# EAGLE design R2P_PS_module (EAGLE 6.4)
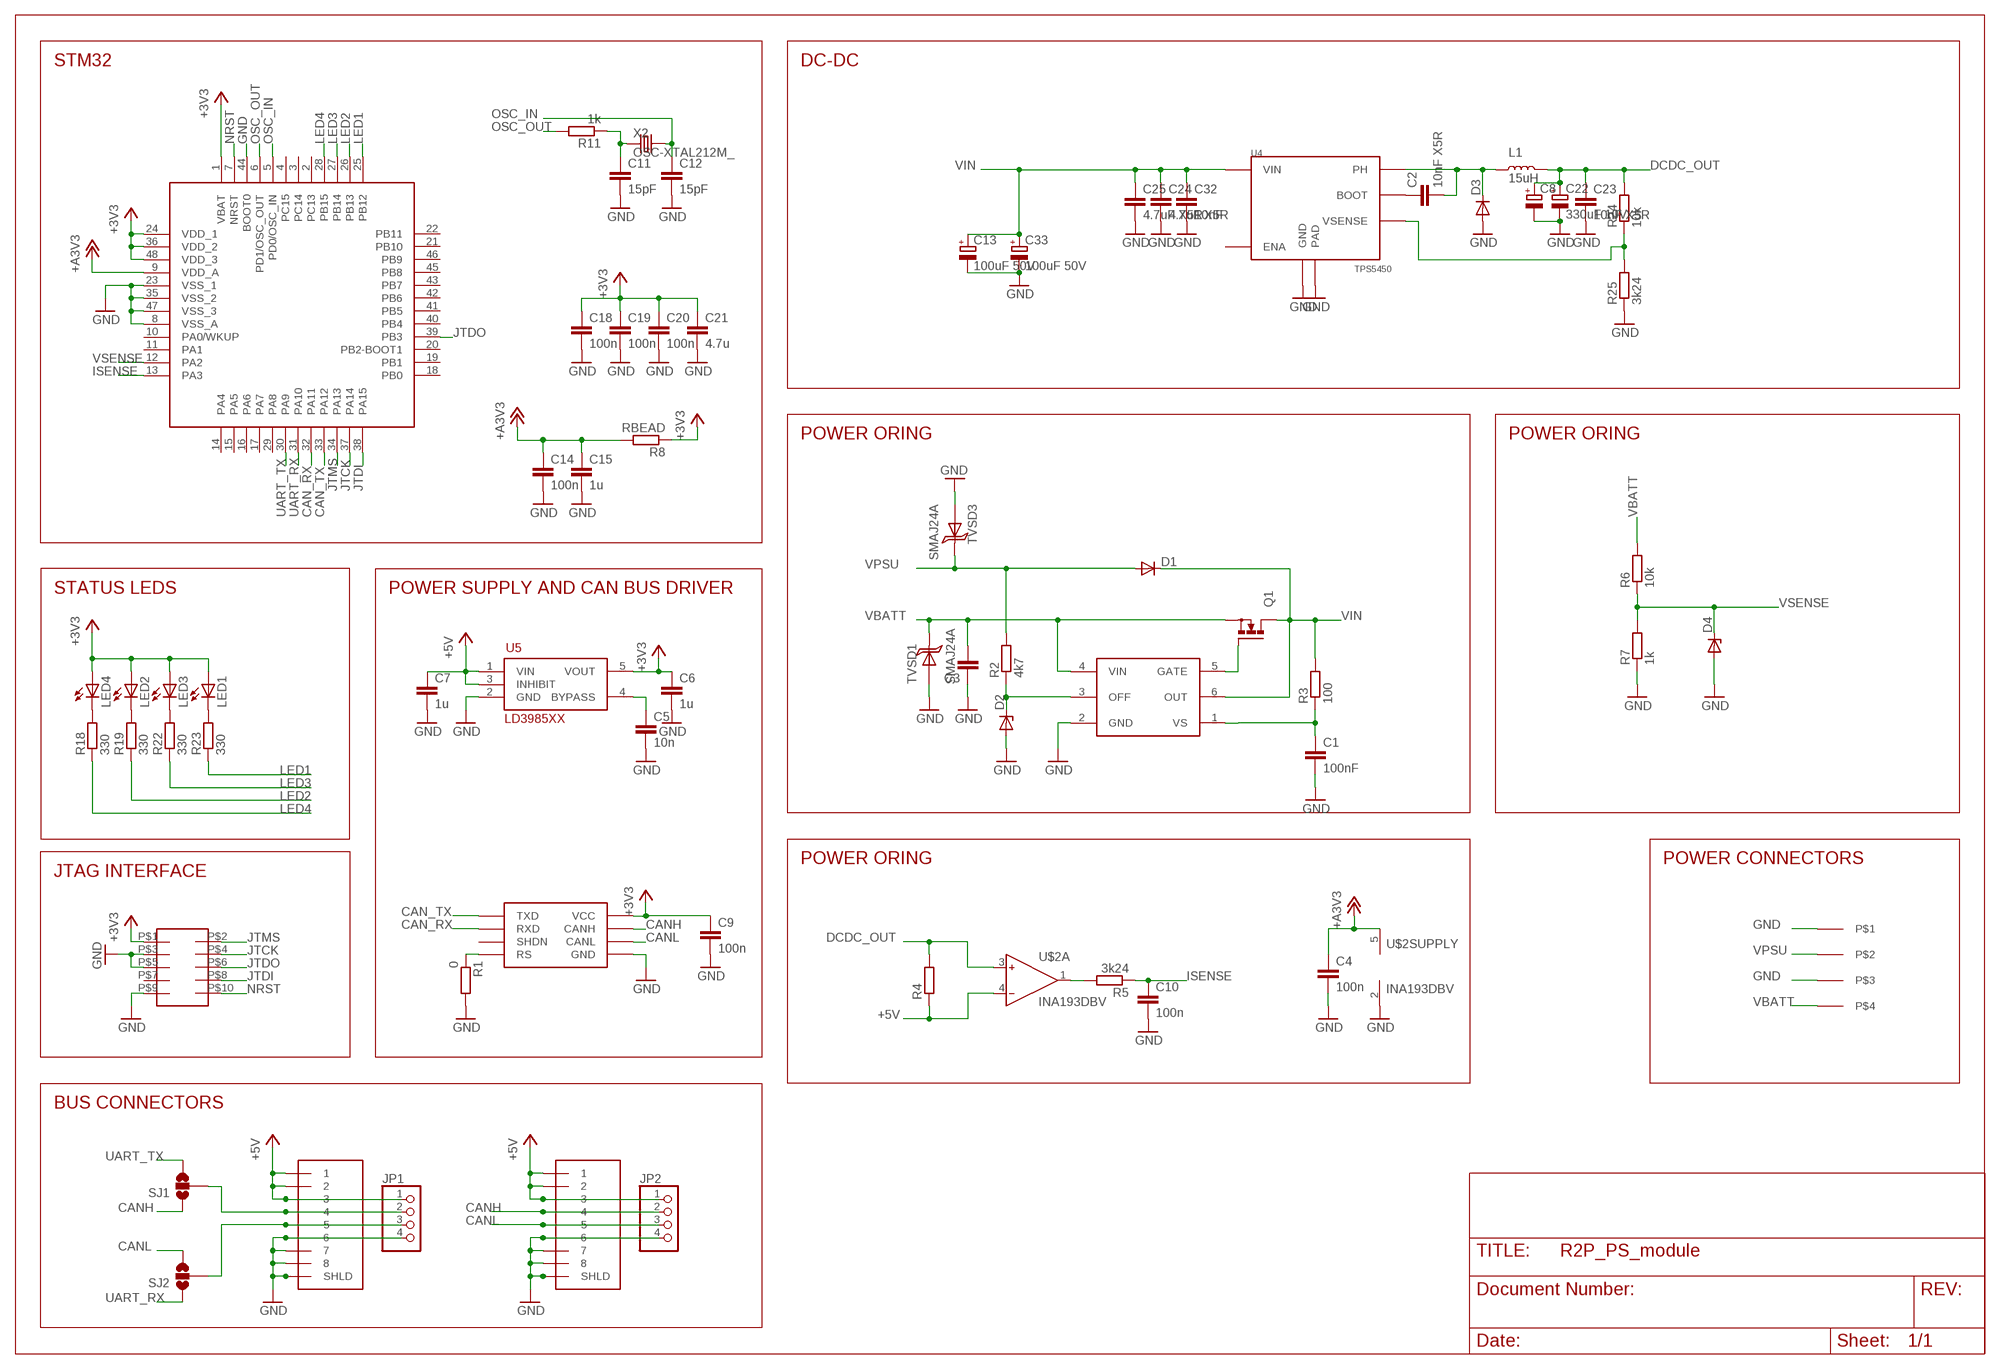
[diagram p0: schematic, sheet 1]

## Parts
1  RJ45-43860  [0438600010]
2  RJ45-43860  [0438600010]
C1  100nF  C-EUC0603  [C0603]
C2  10nF X5R  C-EUC0603  [C0603]
C3  C-EUC0805  [C0805]
C4  100n  C-EUC0603  [C0603]
C5  10n  C-EUC0603  [C0603]
C6  1u  C-EUC0603  [C0603]
C7  1u  C-EUC0603  [C0603]
C8  CPOL-EUE5-10.5  [E5-10,5]
C9  100n  C-EUC0603  [C0603]
C10  100n  C-EUC0603  [C0603]
C11  15pF  C-EUC0603  [C0603]
C12  15pF  C-EUC0603  [C0603]
C13  100uF 50V  CPOL-EUE5-10.5  [E5-10,5]
C14  100n  C-EUC0603  [C0603]
C15  1u  C-EUC0603  [C0603]
C18  100n  C-EUC0603  [C0603]
C19  100n  C-EUC0603  [C0603]
C20  100n  C-EUC0603  [C0603]
C21  4.7u  C-EUC0805  [C0805]
C22  330uF 10V  CPOL-EUE2.5-7  [E2,5-7]
C23  10nF X5R  C-EUC0603  [C0603]
C24  4.7uF X5R  C-EUC1210  [C1210]
C25  4.7uF X5R  C-EUC1210  [C1210]
C32  10nF  C-EUC0603  [C0603]
C33  100uF 50V  CPOL-EUE2.5-7  [E2,5-7]
D1  DIODE-DO-214AC  [DO-214AC]
D2  ZENERSOD-323F  [SOD-323F]
D3  DIODE-DO-214AC  [DO-214AC]
D4  ZENERSOD-323F  [SOD-323F]
JP1  PINHD-1X4/90  [1X04/90]
JP2  PINHD-1X4/90  [1X04/90]
L1  15uH  CDRH127  [CDRH127]
LED1  LEDCHIPLED_0805  [CHIPLED_0805]
LED2  LEDCHIPLED_0805  [CHIPLED_0805]
LED3  LEDCHIPLED_0805  [CHIPLED_0805]
LED4  LEDCHIPLED_0805  [CHIPLED_0805]
Q1  N-MOSFET-SO8S  [SO-08]
R1  0  R-EU_R0603  [R0603]
R2  4k7  R-EU_R0603  [R0603]
R3  100  R-EU_R0603  [R0603]
R4  R-EU_R2512  [R2512]
R5  3k24  R-EU_R0603  [R0603]
R6  10k  R-EU_R0603  [R0603]
R7  1k  R-EU_R0603  [R0603]
R8  RBEAD  R-EU_R0603  [R0603]
R11  1k  R-EU_R0603  [R0603]
R18  330  R-EU_R0603  [R0603]
R19  330  R-EU_R0603  [R0603]
R22  330  R-EU_R0603  [R0603]
R23  330  R-EU_R0603  [R0603]
R24  10k  R-EU_R0603  [R0603]
R25  3k24  R-EU_R0603  [R0603]
SJ1  SOLDERJUMPER_2WAYPASTE1&2  [SJ_3_PASTE1&2]
SJ2  SOLDERJUMPER_2WAYPASTE1&2  [SJ_3_PASTE1&2]
SOT1  MAX3051  [SOT23-8L]
TVSD1  SMAJ24A  TVSDSMA  [SMA]
TVSD3  SMAJ24A  TVSDSMA  [SMA]
U1  STM32F103CX  [LQFP48]
U4  TPS5450  [POWERPAD-SO8]
U5  LD3985XX  [SOT23-5L]
U$1  LM5050-1  [SOT23-6L]
U$2  INA193DBV  [SOT23-5L]
U$3  POWERCONN-4  [POWERCONN-4]
U$4  FTSH-105  [FTSH-105]
X2  OSC-XTAL212M_  [4X6]

## Nets
+3V3: C6.1 C9.1 C18.1 C19.1 C20.1 C21.1 LED1.A LED2.A LED3.A LED4.A R8.1 SOT1.P$3(VCC) U1.1(VBAT) U1.24(VDD_1) U1.36(VDD_2) U1.48(VDD_3) U5.5(VOUT) U$4.P$1
+5V: 1.P$1 1.P$2 1.P$3 2.P$1 2.P$2 2.P$3 C7.1 JP1.1 JP2.1 R4.1 U5.1(VIN) U5.3(INHIBIT) U$2.4(A:IN-)
+A3V3: C4.1 C14.1 C15.1 R8.2 U1.9(VDD_A) U$2.5(SUPPLY:V+)
CAN_RX: SOT1.P$4(RXD) U1.32(PA11)
CAN_TX: SOT1.P$1(TXD) U1.33(PA12)
CANH: 2.P$4 JP2.2 SJ1.1 SOT1.P$7(CANH)
CANL: 2.P$5 JP2.3 SJ2.3 SOT1.P$6(CANL)
DCDC_OUT: C8.+ C22.+ C23.1 L1.P$2 R4.2 R24.2 U$2.3(A:IN+)
GND: 1.P$6 1.P$7 1.P$8 1.P$9(SHLD) 1.P$10 2.P$6 2.P$7 2.P$8 2.P$9(SHLD) 2.P$10 C1.2 C3.1 C4.2 C5.2 C6.2 C7.2 C8.- C9.2 C10.2 C11.2 C12.2 C13.- C14.2 C15.2 C18.2 C19.2 C20.2 C21.2 C22.- C23.2 C24.2 C25.2 C32.2 C33.- D2.A D3.A D4.A JP1.4 JP2.4 R1.2 R7.1 R25.1 SOT1.P$2(GND) TVSD1.A TVSD3.A U1.8(VSS_A) U1.23(VSS_1) U1.35(VSS_2) U1.44(BOOT0) U1.47(VSS_3) U4.P6(GND) U4.PAD U5.2(GND) U$1.2(GND) U$2.2(SUPPLY:V-) U$3.P$1 U$3.P$3 U$4.P$3 U$4.P$5 U$4.P$9
ISENSE: C10.1 R5.1 U1.13(PA3)
JTCK: U1.37(PA14) U$4.P$4
JTDI: U1.38(PA15) U$4.P$8
JTDO: U1.39(PB3) U$4.P$6
JTMS: U1.34(PA13) U$4.P$2
LED1: R23.1 U1.25(PB12)
LED2: R19.1 U1.26(PB13)
LED3: R22.1 U1.27(PB14)
LED4: R18.1 U1.28(PB15)
N$2: R1.1 SOT1.P$8(RS)
N$3: 1.P$4 JP1.2 SJ1.2
N$4: C5.1 U5.4(BYPASS)
N$6: D2.C R2.1 U$1.3(OFF)
N$7: Q1.4(G) U$1.5(GATE)
N$8: 1.P$5 JP1.3 SJ2.2
N$9: C1.1 R3.1 U$1.1(VS)
N$12: C11.1 R11.1 X2.1(X1)
N$14: R5.2 U$2.1(A:OUT)
N$15: LED4.C R18.2
N$18: LED2.C R19.2
N$20: LED3.C R22.2
N$22: LED1.C R23.2
N$38: C2.1 U4.P1(BOOT)
N$48: R24.1 R25.2 U4.P4(VSENSE)
NRST: U1.7(NRST) U$4.P$10
OSC_IN: C12.1 U1.5(PD0/OSC_IN) X2.2(X2)
OSC_OUT: R11.2 U1.6(PD1/OSC_OUT)
PH: C2.2 D3.C L1.P$1 U4.P8(PH)
UART_RX: SJ2.1 U1.31(PA10)
UART_TX: SJ1.3 U1.30(PA9)
VBATT: C3.2 Q1.1(S) Q1.2(S) Q1.3(S) R6.2 TVSD1.C(K) U$1.4(VIN) U$3.P$4
VIN: C13.+ C24.1 C25.1 C32.1 C33.+ D1.C Q1.5(D) Q1.6(D) Q1.7(D) Q1.8(D) R3.2 U4.P7(VIN) U$1.6(OUT)
VPSU: D1.A R2.2 TVSD3.C(K) U$3.P$2
VSENSE: D4.C R6.1 R7.2 U1.12(PA2)
Unconnected: SOT1.P$5(SHDN) U1.2(PC13) U1.3(PC14) U1.4(PC15) U1.10(PA0/WKUP) U1.11(PA1) U1.14(PA4) U1.15(PA5) U1.16(PA6) U1.17(PA7) U1.18(PB0) U1.19(PB1) U1.20(PB2-BOOT1) U1.21(PB10) U1.22(PB11) U1.29(PA8) U1.40(PB4) U1.41(PB5) U1.42(PB6) U1.43(PB7) U1.45(PB8) U1.46(PB9) U4.P5(ENA) U$4.P$7

## Notes on the sheet
- STM32 | DC-DC
- POWER ORING | POWER ORING
- STATUS LEDS | POWER SUPPLY AND CAN BUS DRIVER
- POWER ORING | POWER CONNECTORS
- JTAG INTERFACE
- BUS CONNECTORS

## Library data of the parts
1 2 = molex:RJ45-43860
C1-C7 C9-C12 C14 C15 C18-C21 C23-C25 C32 = rcl:C-EU: CAPACITOR, European symbol
C8 C13 C22 C33 = rcl:CPOL-EU: POLARIZED CAPACITOR, European symbol
D1 D3 = diode:DIODE-: DIODE
D2 D4 = dp_devices:ZENER: Zener Diode SOD-323
JP1 JP2 = pinhead:PINHD-1X4: PIN HEADER
L1 = DCDC:CDRH127
LED1-LED4 = led:LED: LED OSRAM: - CHIPLED LG R971, LG N971, LY N971, LG Q971, LY Q971, LO R971, LY R971 LH N974, LH R974 LS Q976, LO Q976, LY Q976 LO Q996 - Hyper CHIPLED LW Q18S LB Q993, LB Q99A, LB R99A - SideLED LS A670, LO A670, LY A670, LG A670, LP A670 LB A673, LV A673, LT A673, LW A673 LH A674 LY A675 LS A676, LA A676, LO A676, LY A676, LW A676 LS A679, LY A679, LG A679 - Hyper Micro SIDELED® LS Y876, LA Y876, LO Y876, LY Y876 LT Y87S - SmartLED LW L88C, LW L88S LB L89C, LB L89S, LG L890 LS L89K, LO L89K, LY L89K LS L896, LA L896, LO L896, LY L896 - TOPLED LS T670, LO T670, LY T670, LG T670, LP T670 LSG T670, LSP T670, LSY T670, LOP T670, LYG T670 LG T671, LOG T671, LSG T671 LB T673, LV T673, LT T673, LW T673 LH T674 LS T676, LA T676, LO T676, LY T676, LB T676, LH T676, LSB T676, LW T676 LB T67C, LV T67C, LT T67C, LS T67K, LO T67K, LY T67K, LW E67C LS E67B, LA E67B, LO E67B, LY E67B, LB E67C, LV E67C, LT E67C LW T67C LS T679, LY T679, LG T679 LS T770, LO T770, LY T770, LG T770, LP T770 LB T773, LV T773, LT T773, LW T773 LH T774 LS E675, LA E675, LY E675, LS T675 LS T776, LA T776, LO T776, LY T776, LB T776 LHGB T686 LT T68C, LB T68C - Hyper Mini TOPLED® LB M676 - Mini TOPLED Santana® LG M470 LS M47K, LO M47K, LY M47K Source: http://www.osram.convergy.de LUXEON: - LUMILED® LXK2-PW12-R00, LXK2-PW12-S00, LXK2-PW14-U00, LXK2-PW14-V00 LXK2-PM12-R00, LXK2-PM12-S00, LXK2-PM14-U00 LXK2-PE12-Q00, LXK2-PE12-R00, LXK2-PE12-S00, LXK2-PE14-T00, LXK2-PE14-U00 LXK2-PB12-K00, LXK2-PB12-L00, LXK2-PB12-M00, LXK2-PB14-N00, LXK2-PB14-P00, LXK2-PB14-Q00 LXK2-PR12-L00, LXK2-PR12-M00, LXK2-PR14-Q00, LXK2-PR14-R00 LXK2-PD12-Q00, LXK2-PD12-R00, LXK2-PD12-S00 LXK2-PH12-R00, LXK2-PH12-S00 LXK2-PL12-P00, LXK2-PL12-Q00, LXK2-PL12-R00 Source: www.luxeon.com KINGBRIGHT: KA-3528ASYC Source: www.kingbright.com
Q1 = transistor-power:N-MOSFET-SO8: N-Channel MOSFET Example: FDS7760A; N-Channel Logic Level PowerTrench® MOSFET FDS2572; N-Channel UltraFET® Trench MOSFET Source: www.fairchildsemi.com
R1-R8 R11 R18 R19 R22-R25 = rcl:R-EU_: RESISTOR, European symbol
SJ1 SJ2 = SparkFun:SOLDERJUMPER_2WAY: Solder Jumper 2 way solder jumper
SOT1 = maxim:MAX3051
TVSD1 TVSD3 = TVSD:TVSD
U1 = st:STM32F103CX
U4 = DCDC:TPS5450
U5 = st:LD3985XX
U$1 = texas-instruments:LM5050-1
U$2 = texas-instruments:INA193: Current Shunt Monitor -16V to +80V Common-Mode Range
U$3 = misc:POWERCONN-4
U$4 = samtec:FTSH-105
X2 = dp_devices:OSC-XTAL2

## Board
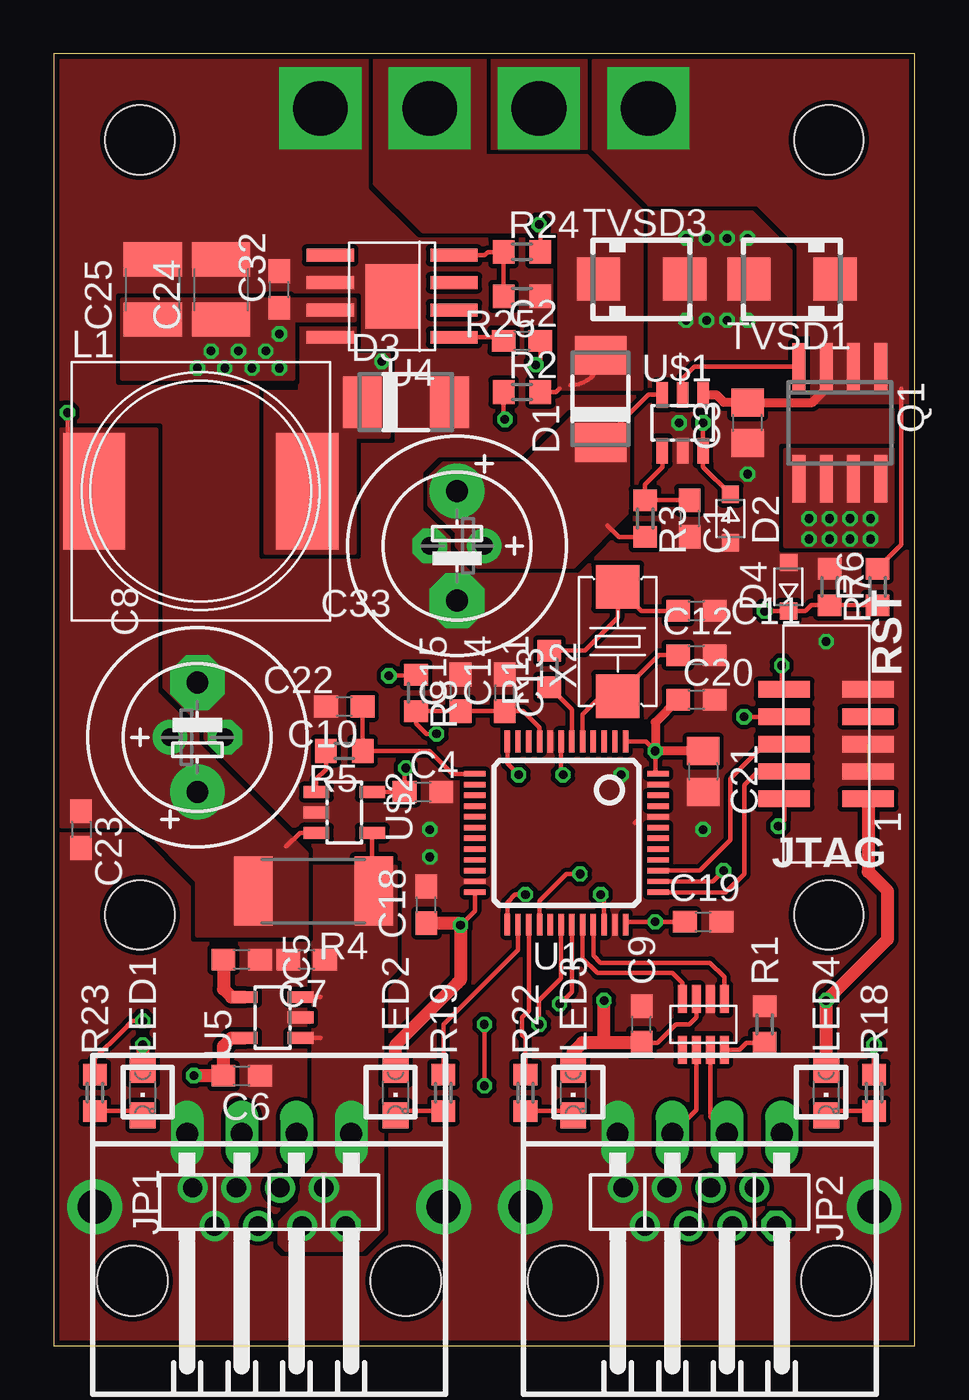
[diagram p1: board, top side]
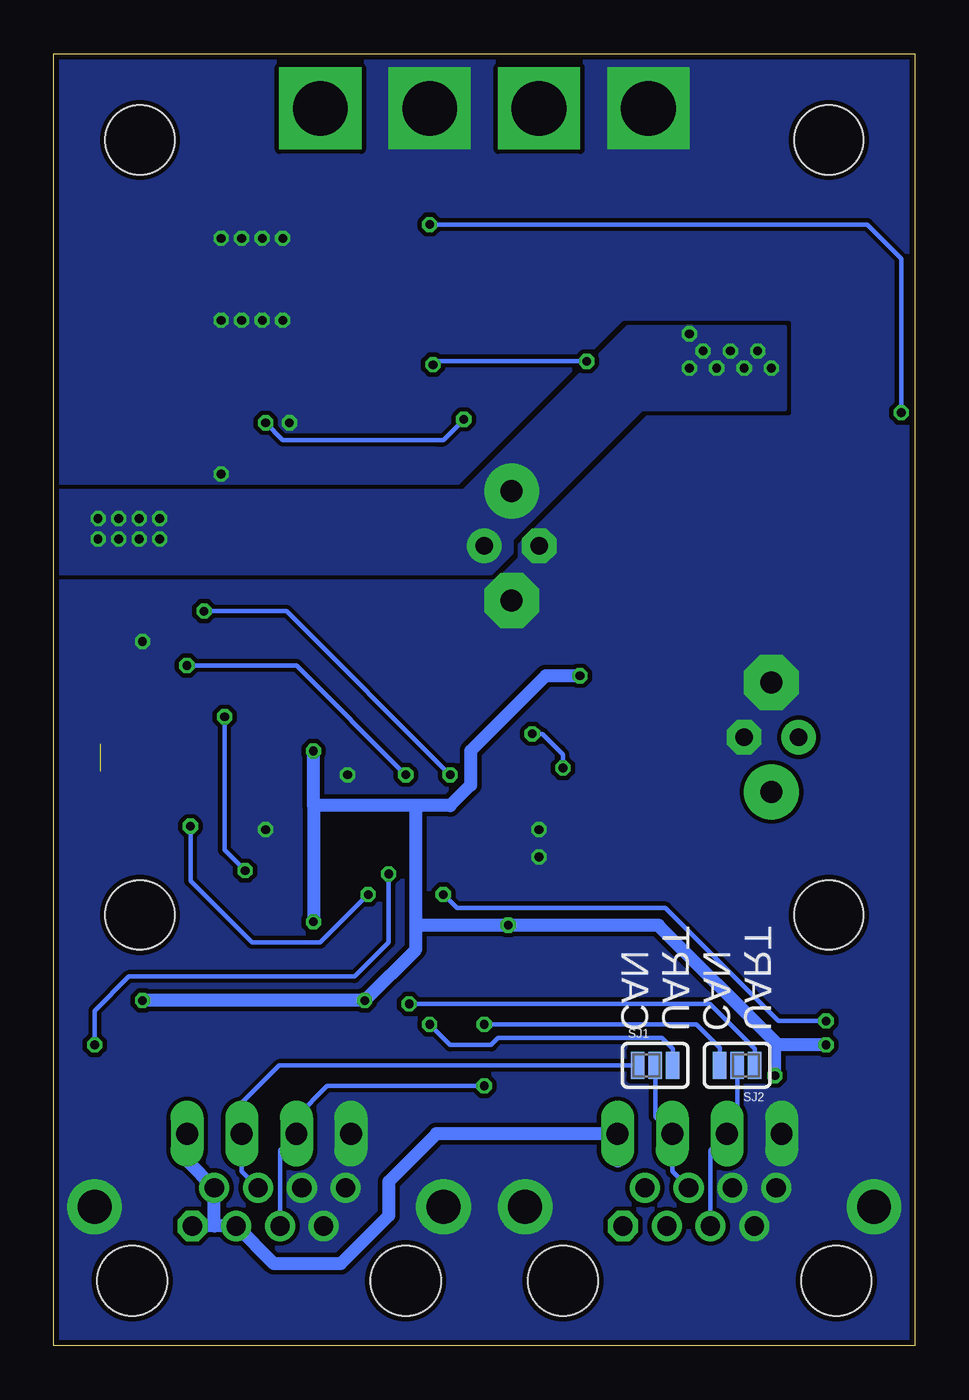
[diagram p2: board, bottom side, seen from below]

Size 40 x 60 mm. Coordinates in mm from the lower left corner, seen from the top.
Outline: 0,0 40,0 40,60 0,60 0,0
Copper layers (1*16): Top 0.035mm / dielectric 1.5mm / Bottom 0.035mm
Design rules "default": minimum track width 8mil, minimum drill 0.3mm, track to track 8mil, track to pad 8mil, pad to pad 8mil, via to via 8mil, smd to smd 0mil, copper to edge 10mil, drill to drill 10mil, minimum pad ring 10mil, minimum via ring 6mil, stop-mask expansion 2mil, vias tented up to drill 100mil, thermal gap 10mil
Holes 3.2 mm at 4,20 36,20 4,56 36,56

### Footprints (pad centres in the part's own frame; a part is rotated, then mirrored left to right if it is on the bottom)
0438600010 = drill 0.889 octagon: P$1 3.556,2.54 | drill 0.889: P$2 2.54,4.318; P$3 1.524,2.54; P$4 0.508,4.318; P$5 -0.508,2.54; P$6 -1.524,4.318; P$7 -2.54,2.54; P$8 -3.556,4.318 | drill 1.575 pad 2.54: P$9 8.103,3.429; P$10 -8.103,3.429 | hole 3.251: -6.35,0; 6.35,0
C0603 = smd 1.1 x 1: 1 -0.85,0; 2 0.85,0
C0805 = smd 1.3 x 1.5: 1 -0.95,0; 2 0.95,0
E5-10,5 = drill 1.016 pad 2.54: + -2.54,0 | drill 1.016 pad 2.54 octagon: - 2.54,0
E2,5-7 = drill 0.813 pad 1.6: + -1.27,0 | drill 0.813 pad 1.6 octagon: - 1.27,0
C1210 = smd 1.6 x 2.7: 1 -1.4,0; 2 1.4,0
DO-214AC = smd 1.8 x 2.4: A 2.025,0; C -2.025,0
SOD-323F = smd 0.8 x 0.8: A 1.125,0; C -1.125,0
1X04/90 = drill 1.016 long: 1 -3.81,-3.81; 2 -1.27,-3.81; 3 1.27,-3.81; 4 3.81,-3.81
CDRH127 = smd 5.4 x 2.9: P$1 0,4.95; P$2 0,-4.95
CHIPLED_0805 = smd 1.2 x 1.2: A 0,-1.05; C 0,1.05
SO-08 = smd 0.6 x 2.2: 1 -1.905,-2.6; 2 -0.635,-2.6; 3 0.635,-2.6; 4 1.905,-2.6; 5 1.905,2.6; 6 0.635,2.6; 7 -0.635,2.6; 8 -1.905,2.6
R0603 = smd 1 x 1.1: 1 -0.85,0; 2 0.85,0
R2512 = smd 1.8 x 3.2: 1 -2.8,0; 2 2.8,0
SJ_3_PASTE1&2 = smd 0.635 x 1.27: 1 -0.813,0; 2 0,0; 3 0.813,0
SOT23-8L@1 = smd 1.3 x 0.42: P$1 -1.175,1.3; P$2 -1.175,0.65; P$3 -1.175,0; P$4 -1.175,-0.65; P$5 1.175,-0.65; P$6 1.175,0; P$7 1.175,0.65; P$8 1.175,1.3
SMA = smd 2 x 2: A 2,0; C -2,0
LQFP48 = smd 1 x 0.25: 1 -4.25,2.75; 2 -4.25,2.25; 3 -4.25,1.75; 4 -4.25,1.25; 5 -4.25,0.75; 6 -4.25,0.25; 7 -4.25,-0.25; 8 -4.25,-0.75; 9 -4.25,-1.25; 10 -4.25,-1.75; 11 -4.25,-2.25; 12 -4.25,-2.75; 25 4.25,-2.75; 26 4.25,-2.25; 27 4.25,-1.75; 28 4.25,-1.25; 29 4.25,-0.75; 30 4.25,-0.25; 31 4.25,0.25; 32 4.25,0.75; 33 4.25,1.25; 34 4.25,1.75; 35 4.25,2.25; 36 4.25,2.75 | smd 0.25 x 1: 13 -2.75,-4.25; 14 -2.25,-4.25; 15 -1.75,-4.25; 16 -1.25,-4.25; 17 -0.75,-4.25; 18 -0.25,-4.25; 19 0.25,-4.25; 20 0.75,-4.25; 21 1.25,-4.25; 22 1.75,-4.25; 23 2.25,-4.25; 24 2.75,-4.25; 37 2.75,4.25; 38 2.25,4.25; 39 1.75,4.25; 40 1.25,4.25; 41 0.75,4.25; 42 0.25,4.25; 43 -0.25,4.25; 44 -0.75,4.25; 45 -1.25,4.25; 46 -1.75,4.25; 47 -2.25,4.25; 48 -2.75,4.25
POWERPAD-SO8 = smd 2.2 x 0.6: P1 -2.875,1.905; P2 -2.875,0.635; P3 -2.875,-0.635; P4 -2.875,-1.905; P5 2.875,-1.905; P6 2.875,-0.635; P7 2.875,0.635; P8 2.875,1.905 | smd 2.49 x 3: PAD 0,0
SOT23-5L = smd 0.55 x 1.2: 1 -0.95,-1.3; 2 0,-1.3; 3 0.95,-1.3; 4 0.95,1.3; 5 -0.95,1.3
SOT23-6L = smd 0.55 x 1.2: 1 -0.95,-1.3; 2 0,-1.3; 3 0.95,-1.3; 4 0.95,1.3; 5 0,1.3; 6 -0.95,1.3
POWERCONN-4 = drill 2.54 pad 3.81 square: P$1 -7.62,0; P$2 -2.54,0; P$3 2.54,0; P$4 7.62,0
FTSH-105 = smd 0.76 x 2.4: P$1 -2.54,-1.95; P$2 -2.54,1.95; P$3 -1.27,-1.95; P$4 -1.27,1.95; P$5 0,-1.95; P$6 0,1.95; P$7 1.27,-1.95; P$8 1.27,1.95; P$9 2.54,-1.95; P$10 2.54,1.95
4X6 = smd 2.032 x 2.032: 1 -2.54,0; 2 2.54,0

### Placement (x,y rotation side)
1  10,3.02 0 top
2  30,3.02 0 top
C1  29.53,38.42 270 top
C2  21.75,46.67 0 top
C3  32.23,42.86 90 top
C4  17.14,25.72 0 top
C5  8.73,17.94 0 top
C6  8.73,12.54 0 top
C7  11.75,17.94 180 top
C8  6.67,28.26 90 top
C9  27.3,14.92 90 top
C10  13.49,29.69 180 top
C11  29.84,34.13 0 top
C12  29.84,32.07 0 top
C13  18.73,37.15 270 top
C14  20.95,30.32 90 top
C15  18.89,30.32 90 top
C18  17.3,20.48 90 top
C19  30.16,19.68 0 top
C20  29.84,30 0 top
C21  30.16,26.67 270 top
C22  6.67,28.26 0 top
C23  1.27,23.97 270 top
C24  7.78,49.05 90 top
C25  4.6,49.05 90 top
C32  10.48,49.05 90 top
C33  18.73,37.15 180 top
D1  25.4,43.97 90 top
D2  31.43,38.42 270 top
D3  16.35,43.81 0 top
D4  34.13,35.24 90 top
JP1  10,6.03 180 top
JP2  30,6.03 180 top
L1  6.83,39.69 270 top
LED1  4.13,11.75 180 top
LED2  15.88,11.75 180 top
LED3  24.13,11.75 180 top
LED4  35.88,11.75 180 top
Q1  36.51,42.86 180 top
R1  33.02,14.92 90 top
R2  21.75,44.29 0 top
R3  27.46,38.42 270 top
R4  12.06,21.11 180 top
R5  13.49,27.62 180 top
R6  38.26,35.24 90 top
R7  36.04,35.24 270 top
R8  16.83,30.32 270 top
R11  23.02,31.43 270 top
R18  38.1,11.75 270 top
R19  18.1,11.75 270 top
R22  21.91,11.75 270 top
R23  1.91,11.75 270 top
R24  21.75,50.8 0 top
R25  21.75,48.74 180 top
SJ1  12.06,13.02 0 bottom
SJ2  8.26,13.02 180 bottom
SOT1  MAX3051  [SOT23-8L@1]  29.84,14.92 270 top
TVSD1  34.29,49.53 180 top
TVSD3  27.3,49.53 0 top
U1  23.81,23.81 270 top
U4  15.72,48.74 180 top
U5  10.16,15.24 90 top
U$1  29.21,42.86 0 top
U$2  13.49,24.77 270 top
U$3  20,57.47 0 top
U$4  35.88,27.94 90 top
X2  26.19,32.7 270 top

### Tracks (layer width: path | path; a pad name or v marks a point on that pad's centre or on a via)
+3V3  (via drill 0.4)
  Top 0.203: C19.1 v27.94,19.68 26.68,19.68 U1.36 | SOT1.P$3 29.84,15.24 29.53,14.92 28.89,14.92 28.04,14.07 C9.1 | LED4.A 35.88,13.97 | v15.56,31.11 16.77,31.11 R8.1 | U1.24 19.56,20.2 v18.89,19.53 | U1.1 27.5,28.06 v27.94,27.62 | v27.94,27.62 27.94,26.68 U1.48
  Top 0.406: C21.1 v27.94,27.62 27.94,28.95 C20.1
  Top 0.61: LED4.A 35.88,13.97 v35.88,16.03 38.73,18.89 38.73,21.11 37.83,22.02 U$4.P$1 | v25.56,16.03 25.56,14.13 25.66,14.13 25.72,14.07 | C9.1 25.72,14.07 | 25.72,14.07 24.55,14.07 24.13,13.65 LED3.A | v6.51,12.54 C6.1 7.88,13.91 8.26,14.29 U5.5 | v4.13,13.97 LED1.A | LED2.A 15.88,13.97 18.73,16.83 18.89,16.99 v18.89,19.53 18.79,19.63 C18.1
  Bottom 0.61: 27.94,25.08 v27.94,19.68 | 27.94,25.08 v27.94,27.62 | 23.18,25.08 27.94,25.08 | 23.18,19.68 23.18,18.41 v25.56,16.03 v35.88,16.03 | 23.18,19.68 23.18,25.08 | 23.18,19.68 23.02,19.53 v18.89,19.53 11.91,19.53 6.51,14.13 | v15.56,31.11 17.14,31.11 20.64,27.62 20.64,26.35 20.64,26.04 21.59,25.08 23.18,25.08 | v6.51,12.54 6.51,14.13 | v4.13,13.97 6.35,13.97 6.51,14.13
+5V
  Top 0.203: U$2.4 14.79,21.18 R4.1 | U5.1 12.38,14.29 | U5.3 12.38,16.19
  Bottom 0.61: 13.81,8.57 JP1.1 22.23,9.84 24.45,7.62 24.45,6.03 26.67,3.81 29.78,3.81 2.P$3 | 2.P$3 32.54,5.56 | 2.P$3 32.54,5.56 | 32.54,5.56 2.P$1 32.54,5.56 | 32.54,5.56 2.P$2 33.81,8.6 JP2.1
  pour Top (rank 2, no thermals): 15.88,22.23 12.06,22.23 12.06,8.26 11.43,7.62 11.43,6.67 10.48,5.71 10.48,4.76 10.79,4.45 14.29,4.45 15.24,5.4 15.24,16.83 15.88,17.46
+A3V3  (via drill 0.4)
  Top 0.203: U$2.5 C4.1 16.3,26.77 v16.35,26.83 | U1.9 22.56,28.71 22.54,28.73 21.8,29.47 C14.1 C15.1 R8.2 16.83,28.89 17.14,28.57 17.3,28.42 v17.78,28.42
  Bottom 0.203: v17.78,28.42 17.3,28.42 16.51,27.62 16.35,27.46 v16.35,26.83
CAN_RX
  Top 0.203: U1.32 24.56,17.98 25.24,17.3 28.73,17.3 29.2,16.84 SOT1.P$4
CAN_TX
  Top 0.203: U1.33 25.06,18.12 25.4,17.78 30.48,17.78 31.11,17.14 31.14,17.11 SOT1.P$1
CANH
  Top 0.203: SOT1.P$7 30.5,10.62 JP2.2
  Bottom 0.203: SJ1.1 29.53,13.02 31.27,11.27 JP2.2 31.27,8.1 2.P$4
CANL  (via drill 0.4)
  Top 0.203: SOT1.P$6 29.84,10.95 JP2.3 | v20,14.92 v20,12.06
  Bottom 0.203: v20,12.06 27.3,12.06 28.73,10.64 JP2.3 29.5,9.08 2.P$5 | v20,14.92 10.16,14.92 9.07,13.83 SJ2.3
DCDC_OUT  (via drill 0.4)
  Top 0.203: U$2.3 11.43,23.82 10.79,23.18 | R24.2 22.6,52.01 v22.54,52.07 | v0.64,43.34 0.64,42.23 0.95,41.91
  Bottom 0.203: v0.64,43.34 0.64,50.48 2.22,52.07 v22.54,52.07
  pour Top (no thermals): 0.32,42.55 4.76,42.55 4.76,30.32 6.67,28.42 6.67,27.94 11.75,22.86 11.75,19.05 6.67,19.05 6.67,21.59 4.13,24.13 0.32,24.13
GND  (via drill 0.4)  (1 unrouted)
  Top 0.203: 27.15,24.45 26.99,24.29
  other vias: 35.88,32.7 31.27,51.44 30.32,51.44 32.23,51.44 29.37,51.44 29.37,47.62 30.32,47.62 31.27,47.62 32.23,47.62 29.05,42.86 32.23,40.48 17.46,23.97 17.46,22.7 26.35,26.51 30.16,23.97
  pour Top (rank 6, no thermals): 0,0 40,0 40,60 0,60
  pour Bottom (rank 6, no thermals): 0,0 40.01,0 40.01,60.1 0,60.1
  pour Top (no thermals): 27.94,51.12 33.66,51.12 33.66,47.94 27.94,47.94
  pour Top (no thermals): 16.99,45.72 19.68,45.72 19.68,42.23 16.99,42.23
ISENSE
  Top 0.203: U1.13 18.52,26.56 18.41,26.67 17.46,27.62 R5.1 C10.1
JTCK
  Top 0.203: 32.7,26.67 32.07,26.04 32.07,21.91 31.27,21.11 31.22,21.06 U1.37
  Top 0.254: 32.7,26.67 U$4.P$4
JTDI  (via drill 0.4)
  Top 0.203: v32.07,29.21 U$4.P$8 | U1.38 30.61,21.56 v31.11,22.07
  Bottom 0.203: v31.11,22.07 32.07,23.02 v32.07,29.21
JTDO
  Top 0.203: 33.02,27.94 31.43,26.35 31.43,23.81 31.43,23.5 30,22.06 U1.39
  Top 0.254: 33.02,27.94 U$4.P$6
JTMS  (via drill 0.4)
  Top 0.203: U$4.P$2 33.93,24.4 v33.66,24.13 | U1.34 25.56,20.79 v25.4,20.95
  Bottom 0.203: v25.4,20.95 27.62,18.73 30.8,18.73 33.66,21.59 v33.66,24.13
LED1  (via drill 0.4)
  Top 0.203: U1.25 21.06,20.59 21.43,20.95 v21.91,20.95 | R23.1 1.91,13.34 3.17,14.61 3.65,15.08 v4.13,15.08
  Bottom 0.203: v4.13,15.08 6.35,15.08 11.59,20.32 21.27,20.32 v21.91,20.95
LED2
  Top 0.203: R19.1 18.1,14.92 21.56,18.39 U1.26
LED3
  Top 0.203: R22.1 21.91,14.29 21.75,14.45 21.75,15.24 22.06,15.55 U1.27
LED4  (via drill 0.4)
  Top 0.203: v24.45,21.91 23.81,21.91 22.56,20.66 U1.28 | v38.1,13.97 R18.1
  Bottom 0.203: v24.45,21.91 24.45,18.73 26.04,17.14 36.51,17.14 38.1,15.56 v38.1,13.97
N$2
  Top 0.203: R1.1 32.17,14.07 32.07,13.97 31.84,13.75 SOT1.P$8
N$3
  Bottom 0.203: SJ1.2 12.06,10.64 JP1.2 11.27,8.1 1.P$4
N$4
  Top 0.61: U5.4 8.26,16.19 7.88,16.57 C5.1
N$6  (via drill 0.4)
  Top 0.203: D2.C 30.16,40.81 U$1.3 v30.16,42.86 | R2.1 20.9,43.08 v20.95,43.02
  Bottom 0.203: v30.16,42.86 29.37,42.07 22.23,42.07 21.91,42.07 v20.95,43.02
N$7
  Top 0.203: Q1.4 29.75,45.46 29.21,44.93 U$1.5
N$8
  Bottom 0.203: SJ2.2 8.26,10.32 JP1.3 9.49,9.08 1.P$5
N$9
  Top 0.203: C1.1 R3.1 27.46,40.01 27.94,40.48 28.26,40.8 U$1.1
N$12
  Top 0.203: R11.1 24.66,32.28 26.04,33.66 26.19,33.81 X2.1 27.3,34.13 C11.1
N$14
  Top 0.203: U$2.1 12.19,26.32 12.64,26.77 R5.2
N$15
  Top 0.203: R18.2 36.08,10.9 LED4.C
N$18
  Top 0.203: R19.2 16.07,10.9 LED2.C
N$20
  Top 0.203: R22.2 23.93,10.9 LED3.C
N$22
  Top 0.203: R23.2 3.93,10.9 LED1.C
N$38
  Top 0.203: U4.P1 20.74,46.83 arc-90 C2.1
N$48
  Top 0.203: U4.P4 20,50.64 20.16,50.8 R24.1 R25.2
NRST  (via drill 0.4)
  Top 0.203: U1.7 23.56,26.6 v23.65,26.51 | U$4.P$10 33.81,30.59 v33.81,31.59
  Bottom 0.203: v23.65,26.51 28.73,31.59 v33.81,31.59
OSC_IN
  Top 0.203: U1.5 24.56,29.32 25.08,29.84 25.4,30.16 X2.2 28.1,32.07 C12.1
OSC_OUT
  Top 0.203: U1.6 24.06,29.54 R11.2
PH  (via drill 0.4)
  Top 0.203: C2.2 22.6,45.78 v22.38,45.56
  Bottom 0.203: v15.24,45.72 22.23,45.72 v22.38,45.56
  pour Top (rank 2, no thermals): 11.43,47.31 13.97,47.31 13.97,46.04 15.56,46.04 15.56,42.23 13.97,42.23 13.97,36.83 9.84,36.83 9.84,44.29 11.43,44.29
UART_RX  (via drill 0.4)
  Top 0.203: U1.31 24.06,16.44 v23.5,15.88
  Bottom 0.203: v23.5,15.88 9.53,15.88 7.44,13.79 SJ2.1
UART_TX  (via drill 0.4)
  Top 0.203: U1.30 23.56,17.05 22.54,16.03 v22.54,14.92
  Bottom 0.203: v22.54,14.92 21.59,13.97 19.68,13.97 19.37,14.29 11.75,14.29 11.25,13.79 SJ1.3
VBATT
  Top 0.203: R6.2 39.37,37.2 39.37,44.45
  Top 0.406: U$1.4 30.77,44.16 31.11,43.81 C3.2 35.24,43.81 35.88,44.45 Q1.3
  pour Top (rank 2, no thermals): 25.08,59.69 40.01,59.69 40.01,43.81 35.24,43.81 35.24,46.99 34.61,46.99 34.61,51.12 32.7,53.02 25.08,53.02
VIN  (via drill 0.4)
  Top 0.203: U$1.6 27.61,44.16 D1.C | R3.2 26.25,37.57 25.72,38.1
  other vias: 37.94,37.47 37.94,38.42 36.99,38.42 36.04,38.42 35.08,38.42 10.48,46.99 9.84,46.2 8.57,46.2 7.3,46.2 9.21,45.4 10.48,45.4 7.94,45.4 6.67,45.4 36.99,37.47 36.04,37.47 35.08,37.47
  pour Top (no thermals): 3.17,48.58 13.97,48.58 13.97,47.62 11.11,47.62 11.11,44.93 3.17,44.93
  pour Top (no thermals): 39.05,41.59 39.05,37.15 33.97,37.15 33.97,41.59
  pour Bottom (no thermals): 19.68,35.88 40.01,35.88 40.01,39.69 20.95,39.69 13.34,47.31 6.03,47.31 6.03,43.5 12.7,43.5 18.73,37.47 18.73,36.83
  pour Top (no thermals): 26.67,43.18 26.67,38.73 24.13,36.2 19.68,36.2 18.73,37.15 18.73,37.78 17.46,39.05 17.46,40.32 18.1,40.96 21.91,40.96 24.13,43.18
VPSU
  Top 0.203: 24.01,44.61 arc90 D1.A | R2.2 23.34,44.29 23.5,44.45
  pour Top (no thermals): 14.92,60.01 20,60.01 20,55.24 24.77,55.24 27.3,52.7 27.3,44.45 23.5,44.45 23.5,51.75 17.14,51.75 14.92,53.98
VSENSE  (via drill 0.4)
  Top 0.203: R6.1 R7.2 35.19,34.39 34.91,34.12 D4.C v33.02,34.12 | U1.12 21.06,27.04 v21.59,26.51
  Bottom 0.203: v33.02,34.12 29.2,34.12 v21.59,26.51

### Text on the board
_tsilk: RST | 1 | JTAG
_bsilk: UART | CAN | UART | CAN